# Altium project EPS Subsystem.PrjPcb
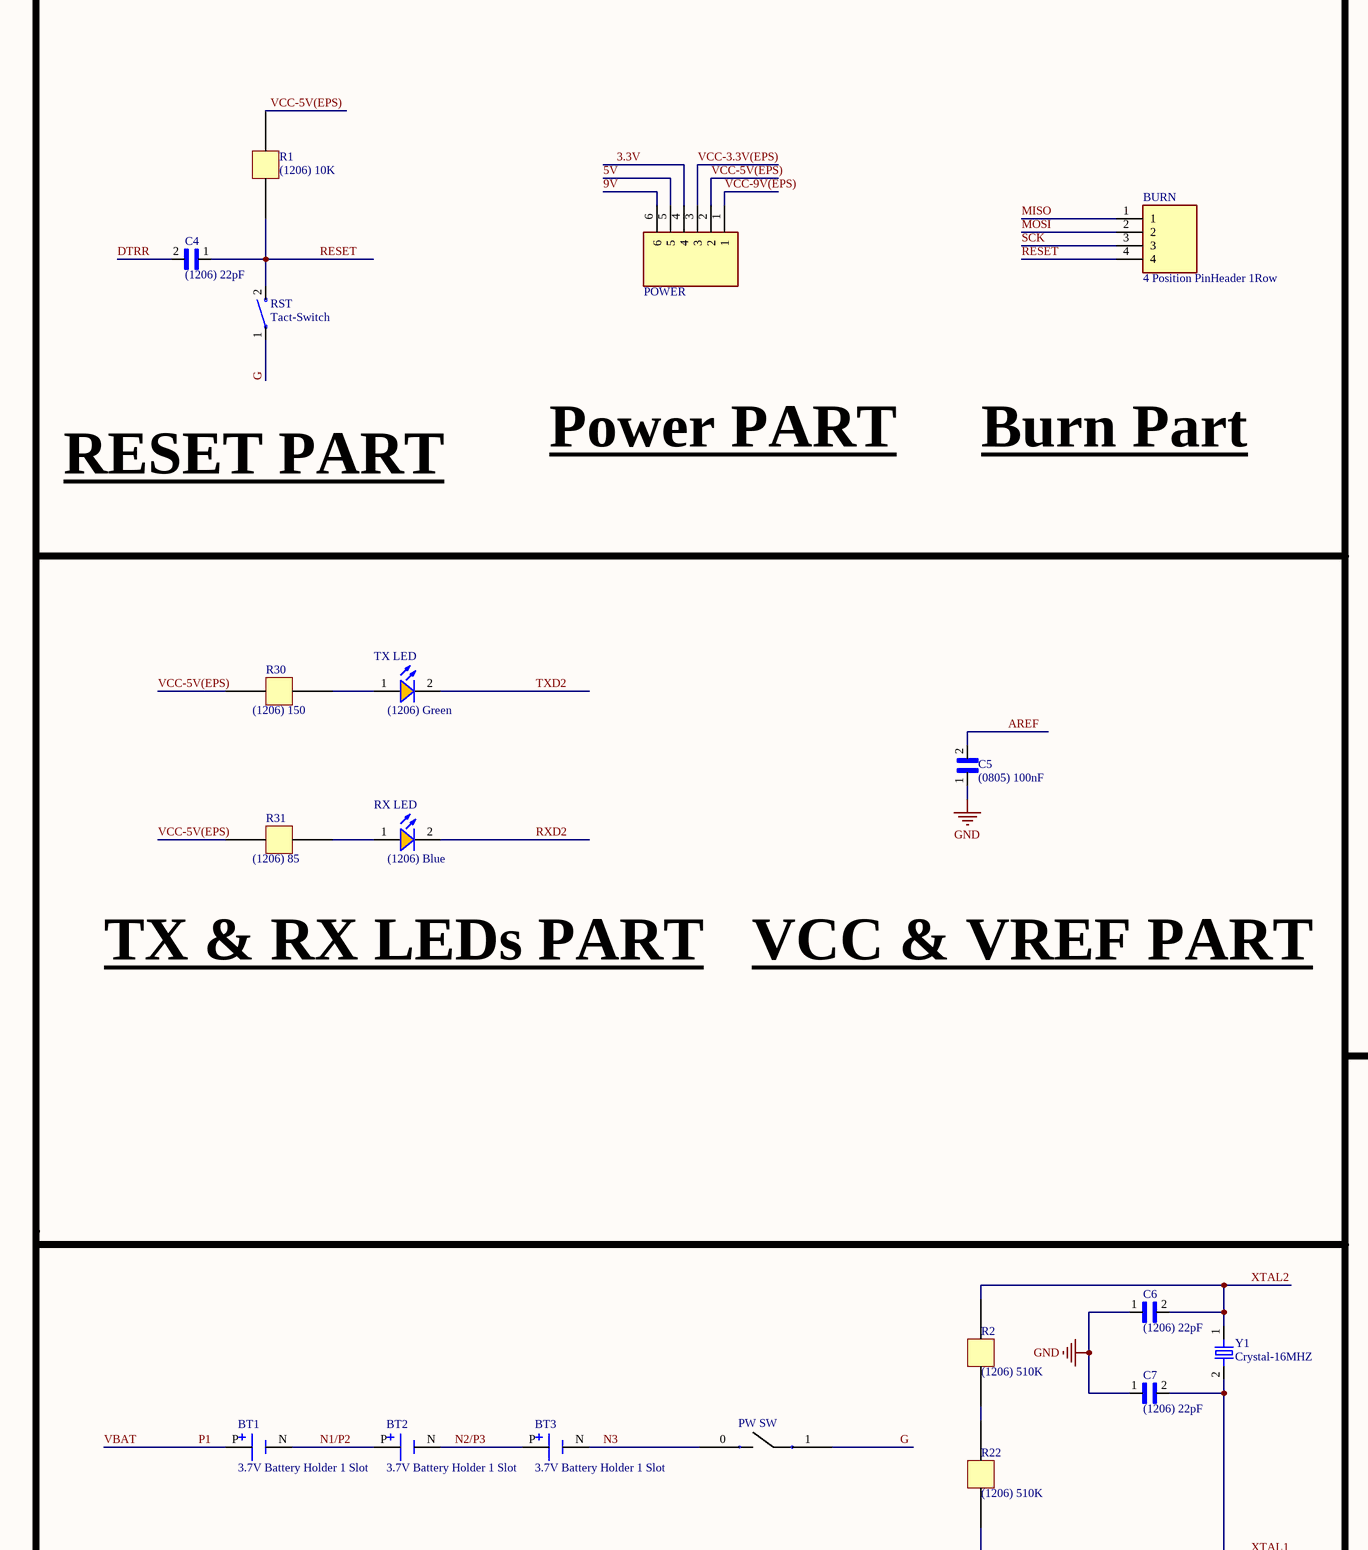
[diagram p0: EPS Subsystem.SchDoc, top left]
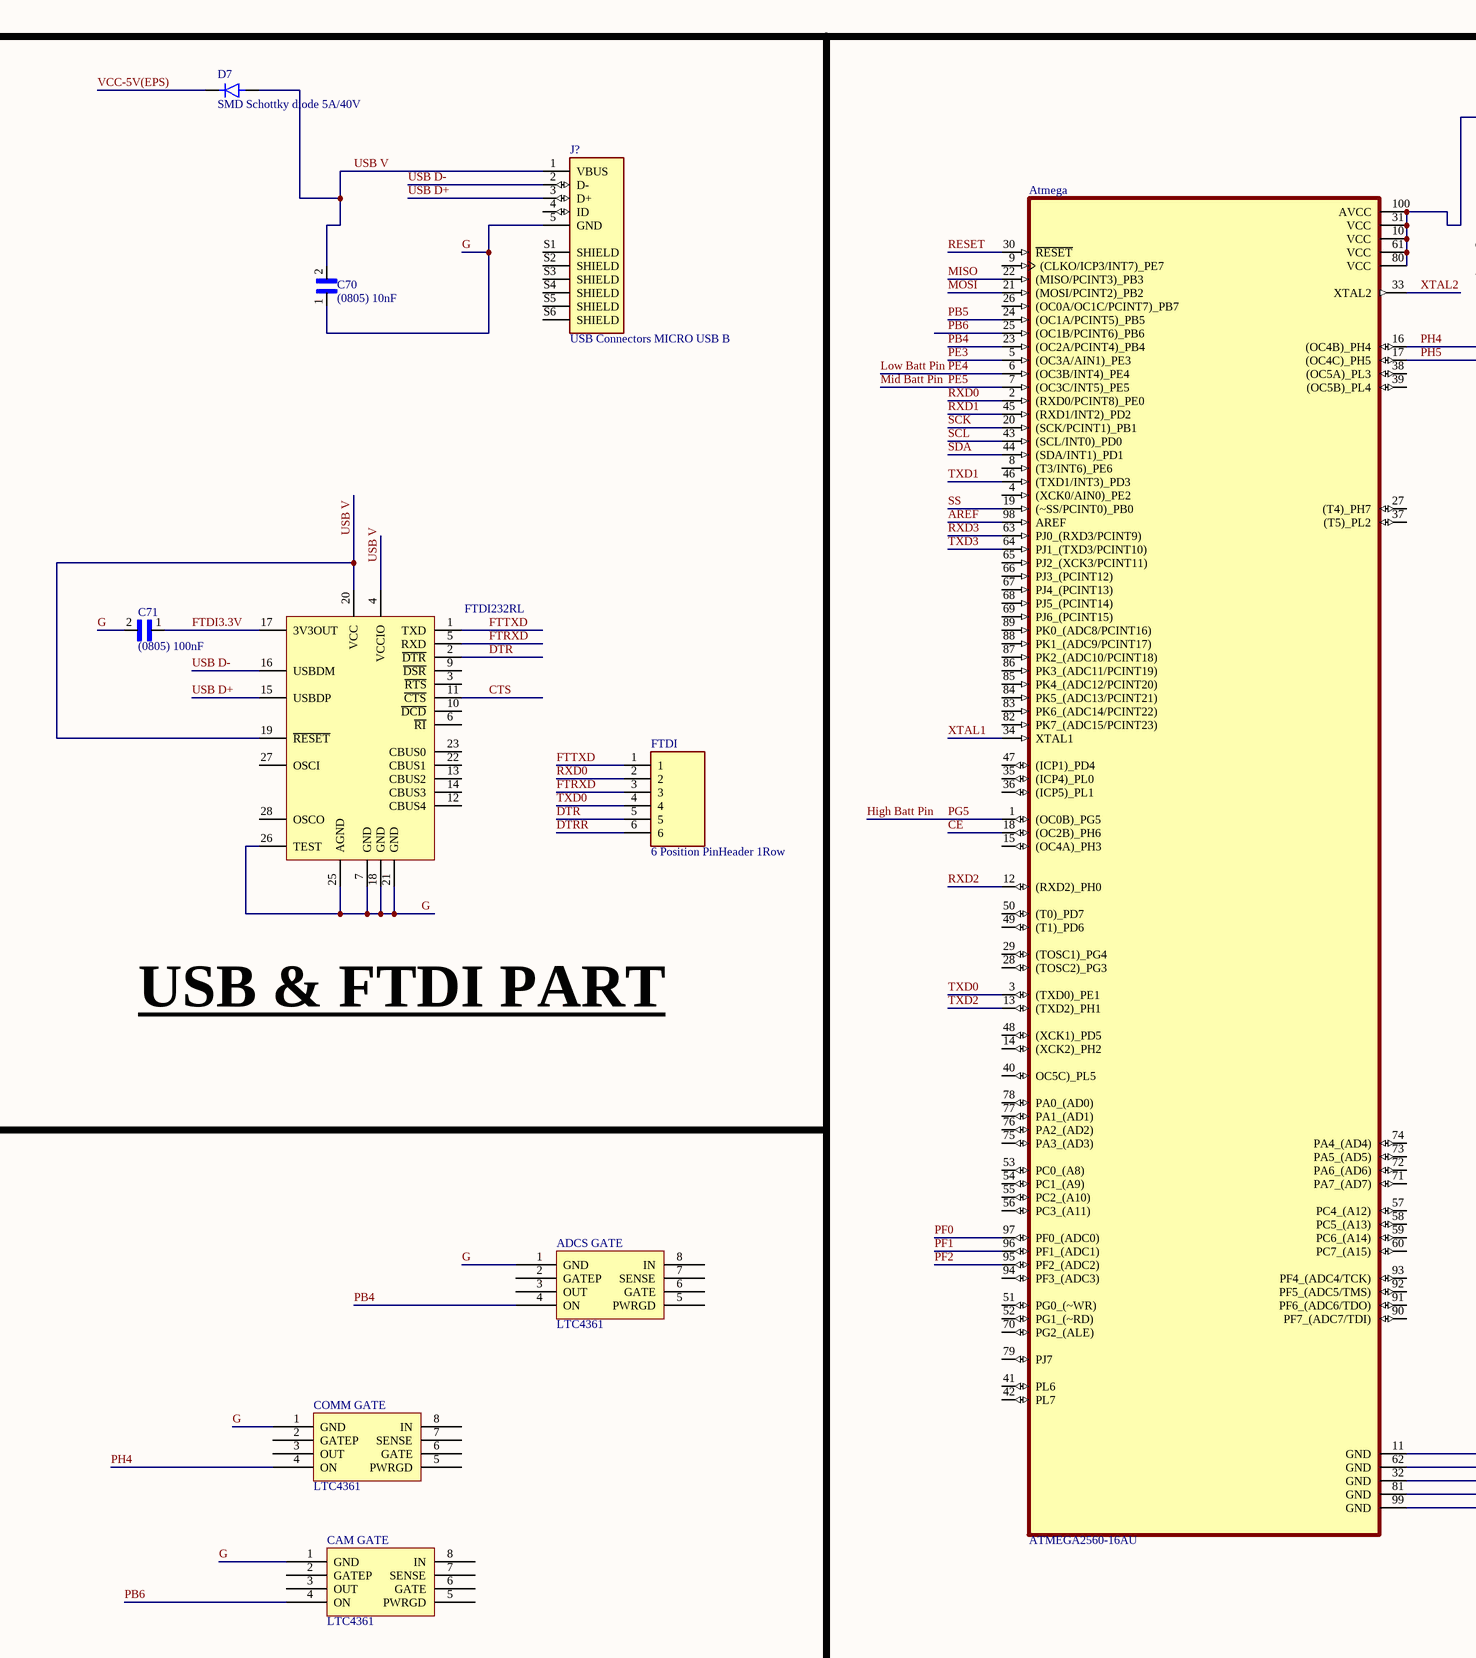
[diagram p1: EPS Subsystem.SchDoc, top middle]
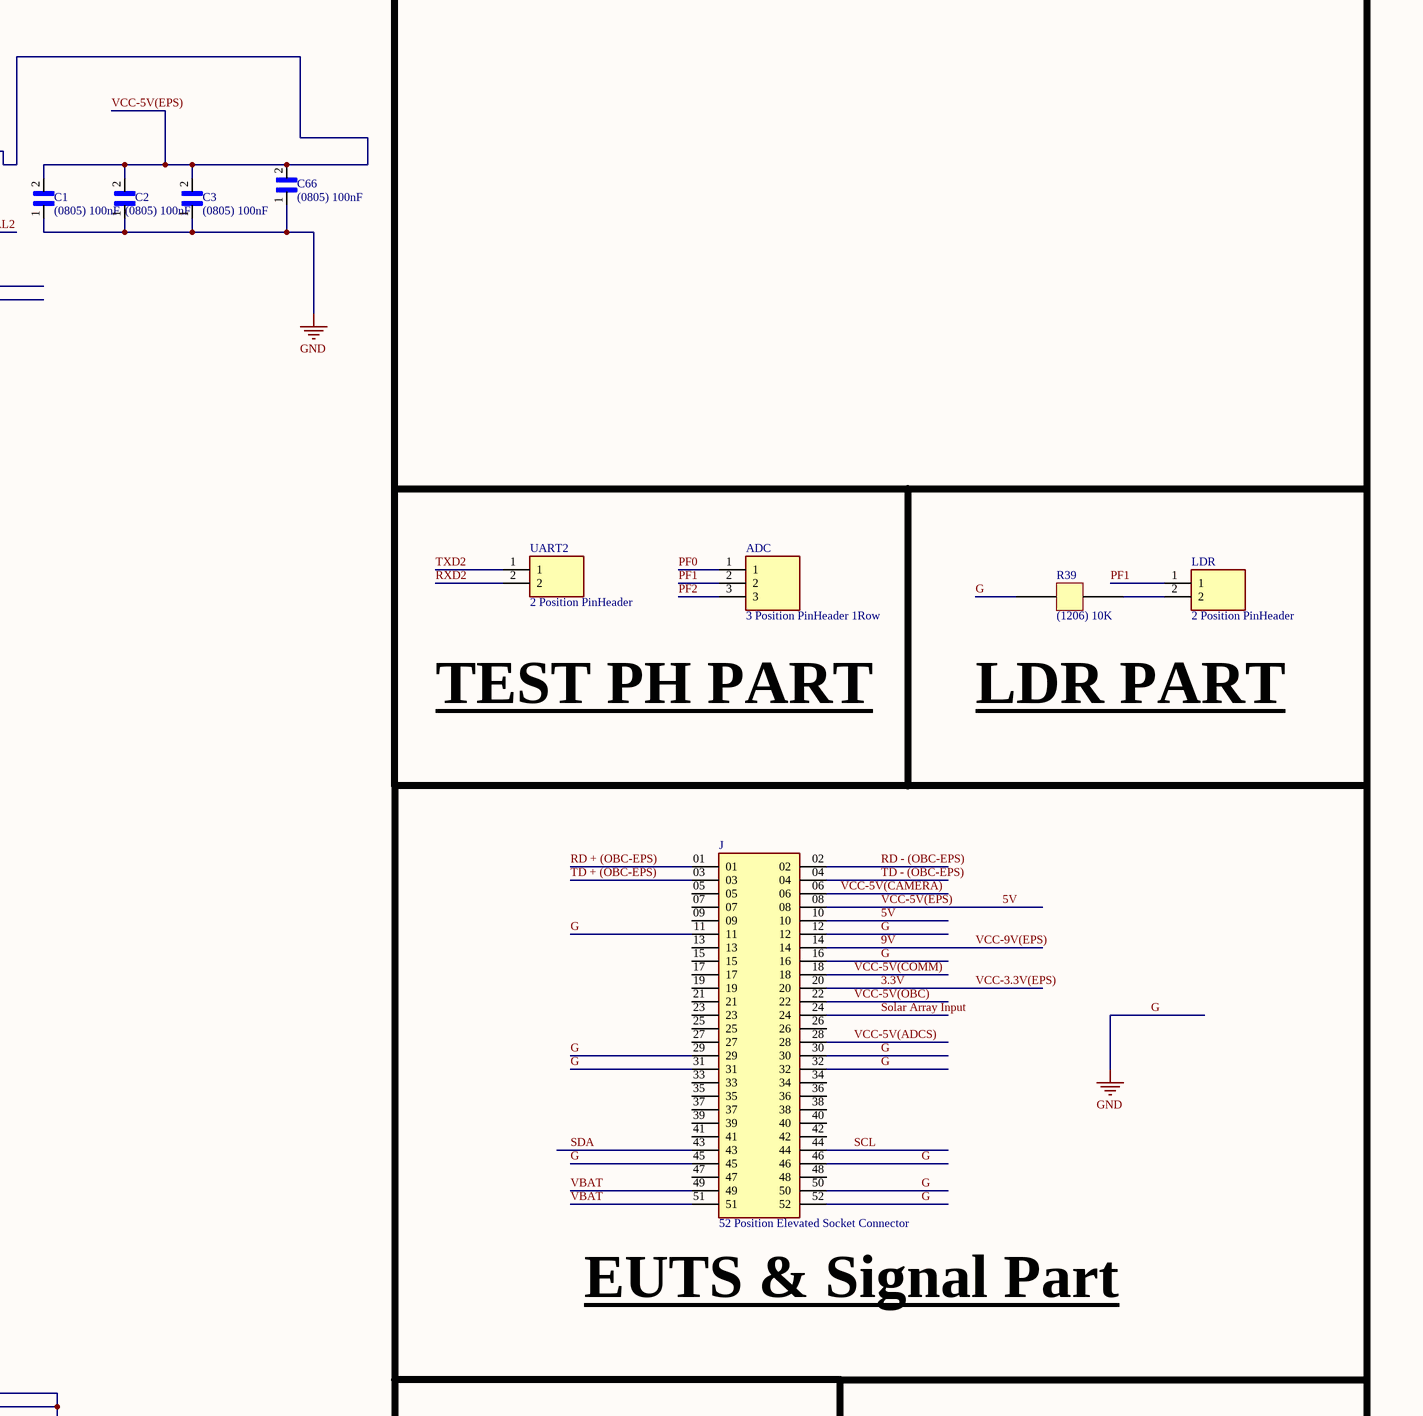
[diagram p2: EPS Subsystem.SchDoc, top right]
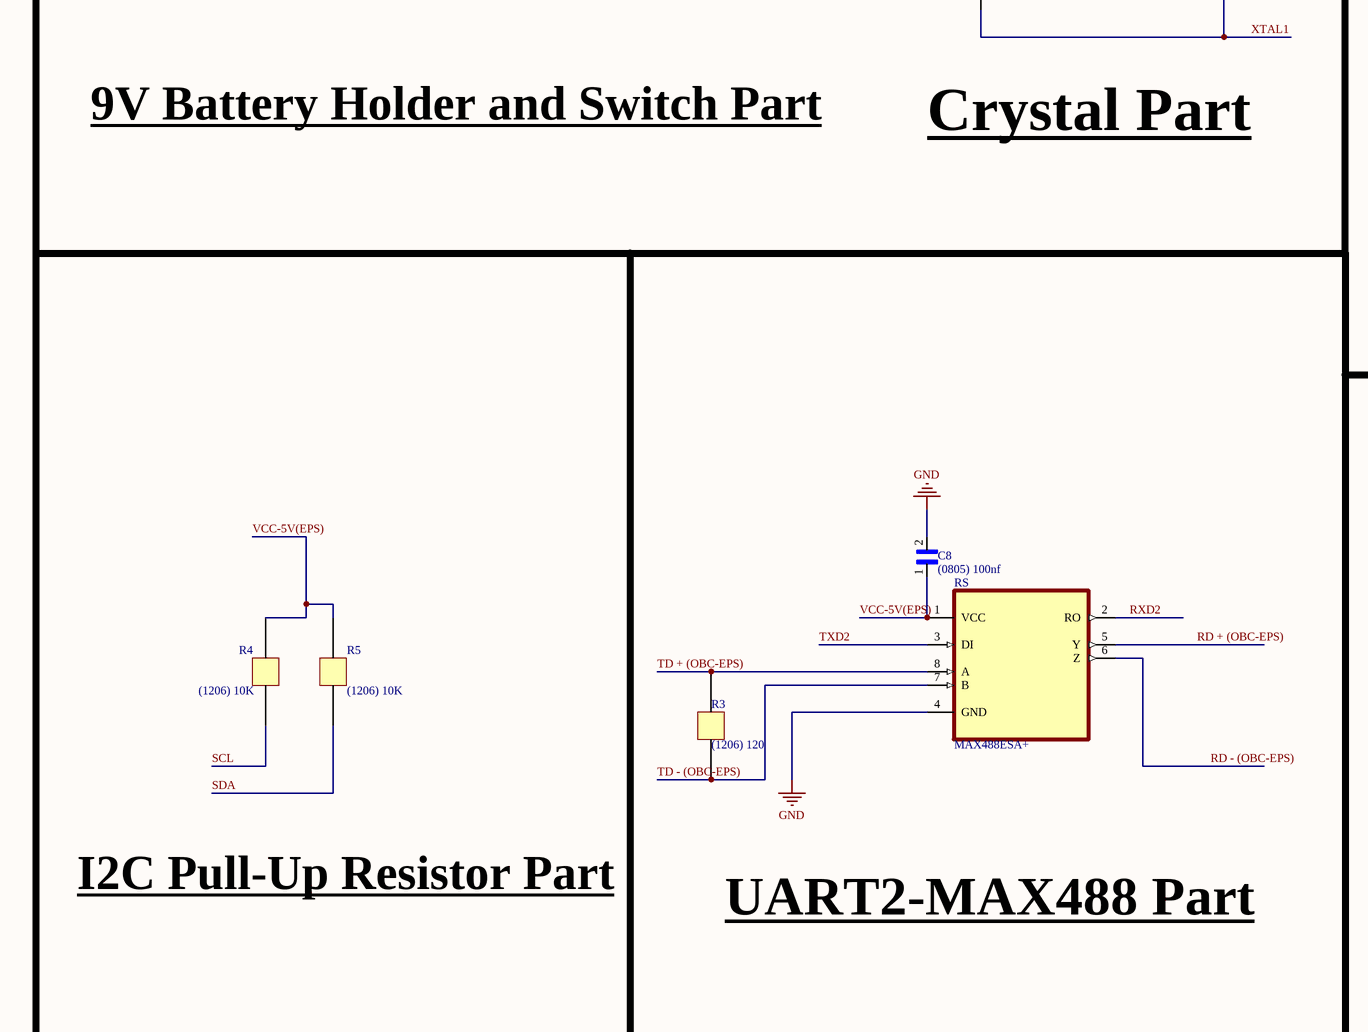
[diagram p3: EPS Subsystem.SchDoc, bottom left]
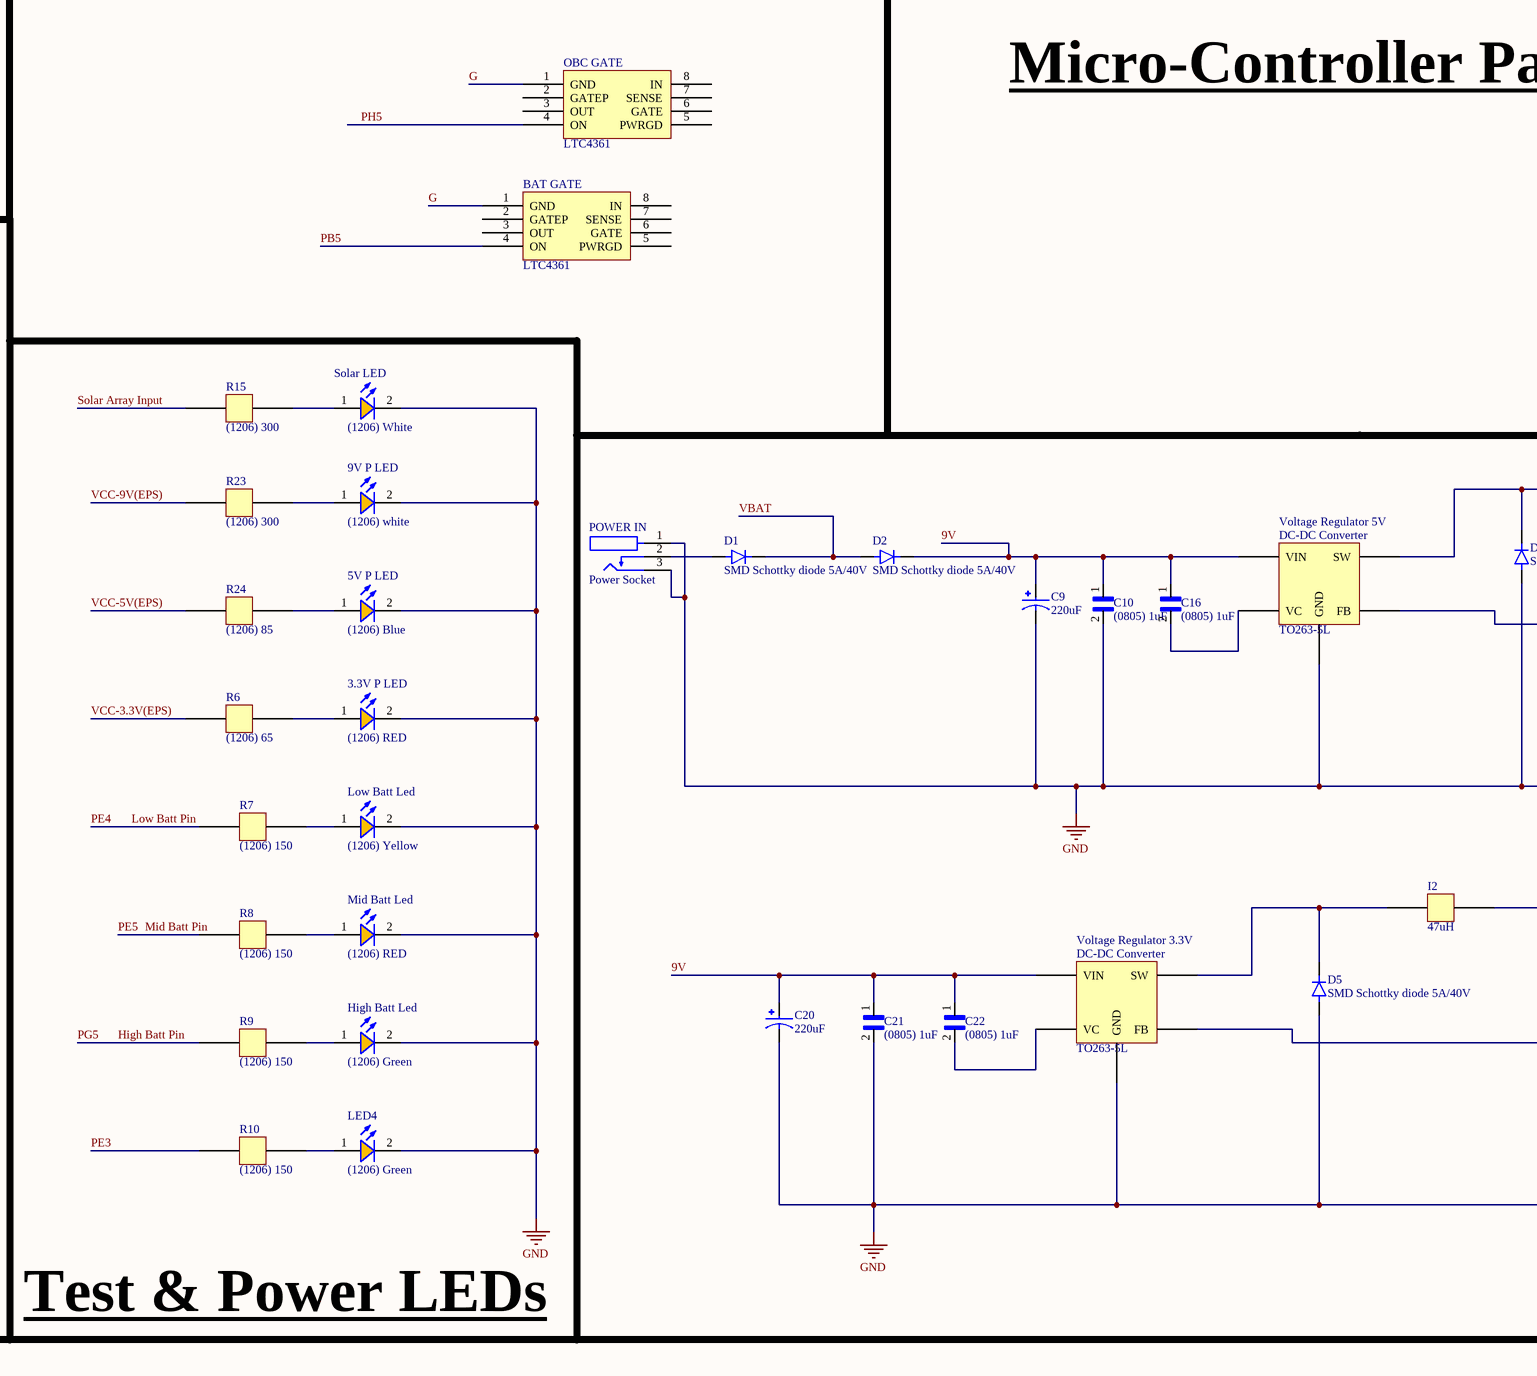
[diagram p4: EPS Subsystem.SchDoc, bottom middle]
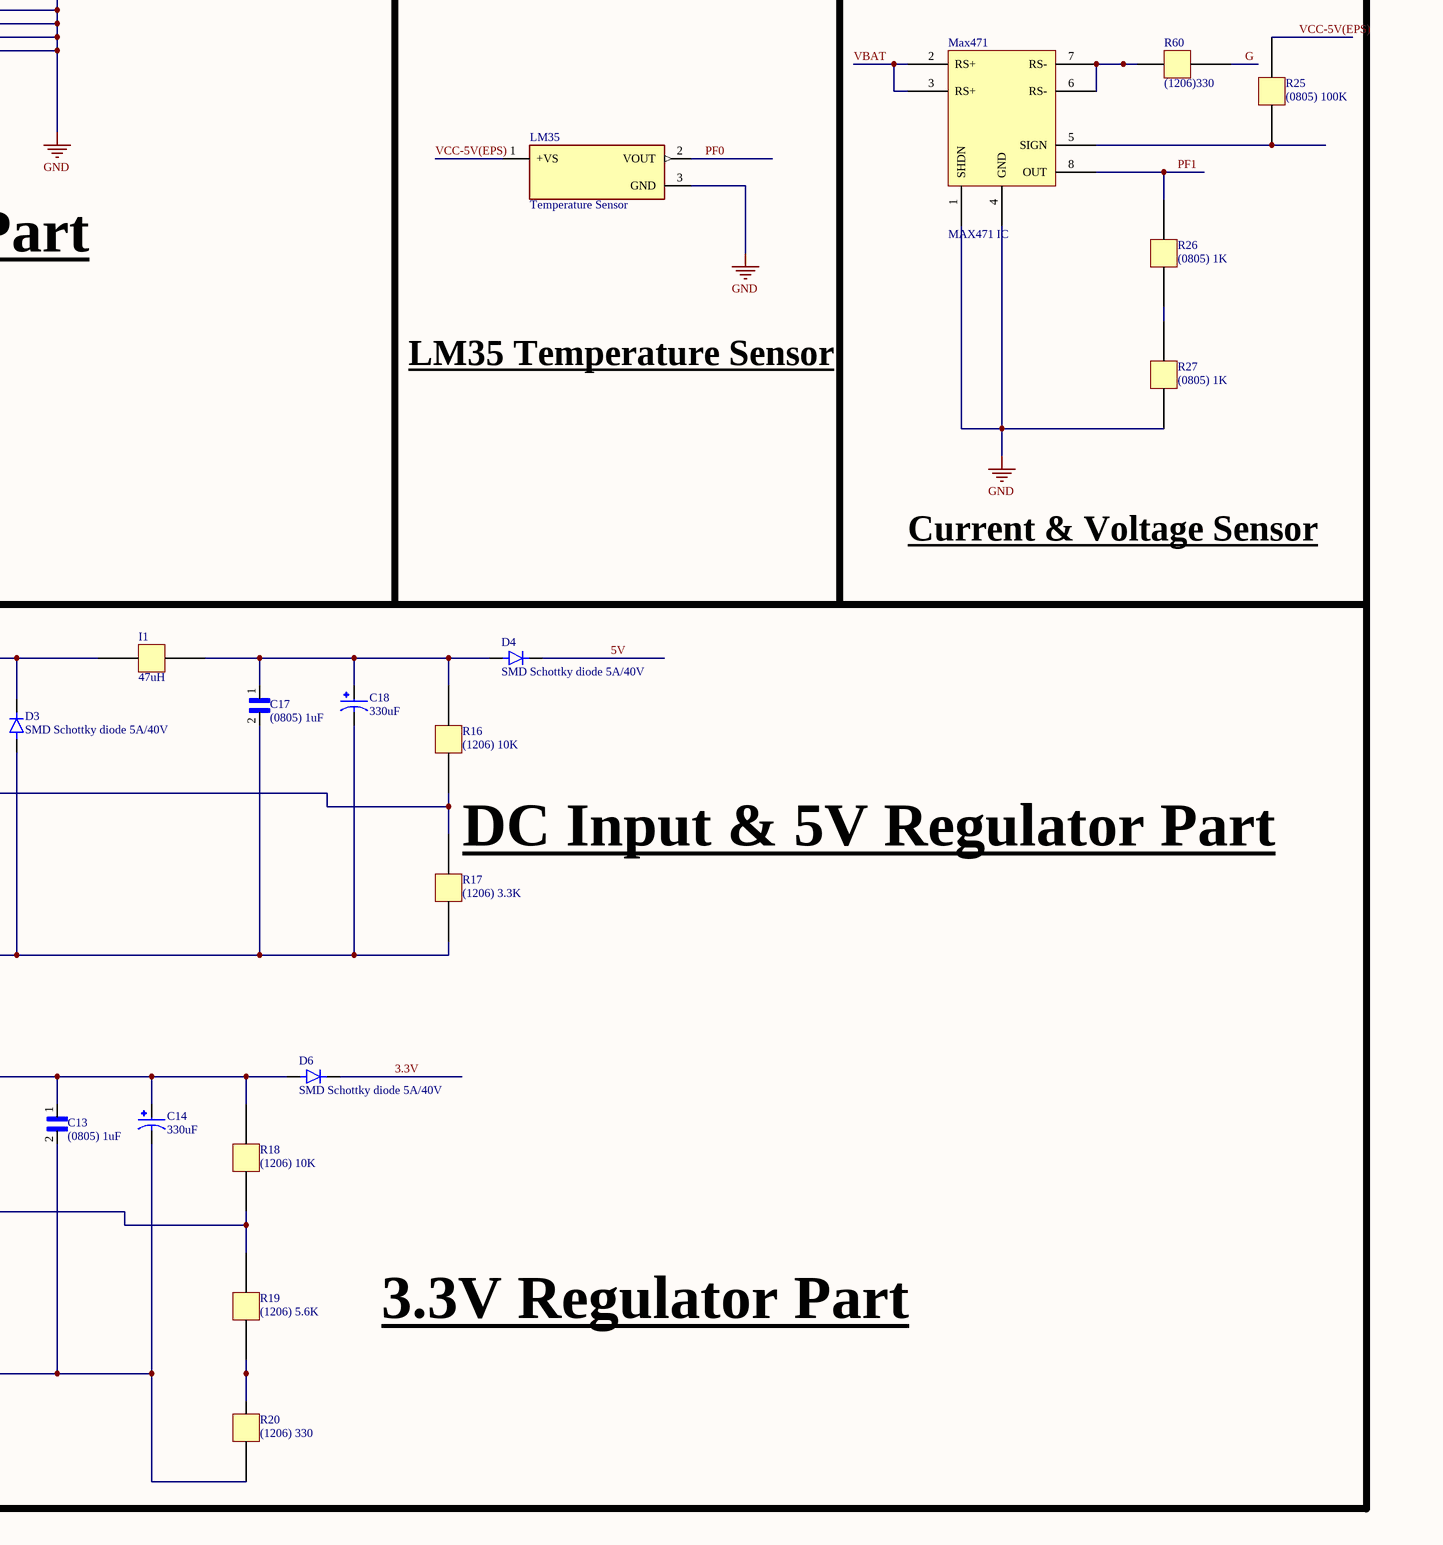
[diagram p5: EPS Subsystem.SchDoc, bottom right]
1 sheet, 93 parts. Net scope: global (net labels, ports and power ports of the same name join across sheets).
Board file: EPS Subsystem.PcbDoc

## Sheet EPS Subsystem.SchDoc
size A1; SheetNumber: 1; SheetTotal: 1

### Parts
3.3V_P_LED  (1206) RED  [RESC3015X65-01]
5V_P_LED  (1206) Blue  [RESC3015X65-01]
9V_P_LED  (1206) white  [RESC3015X65-01]
ADC  3 Position PinHeader 1Row  [TE_3-103327-3]
ADCS_GATE  LTC4361  [LTC4361]
Atmega  ATMEGA2560-16AU  [QFP50P1600X1600X120-100N]
BAT_GATE  LTC4361  [LTC4361]
BT1  3.7V Battery Holder 1 Slot  [BAT_BH-18650-PC]
BT2  3.7V Battery Holder 1 Slot  [BAT_BH-18650-PC]
BT3  3.7V Battery Holder 1 Slot  [BAT_BH-18650-PC]
BURN  4 Position PinHeader 1Row  [TE_3-644456-4]
C1  (0805) 100nF  [CAPC2012X95N-0]
C2  (0805) 100nF  [CAPC2012X95N-0]
C3  (0805) 100nF  [CAPC2012X95N-0]
C4  (1206) 22pF  [CAPC3216X125N0]
C5  (0805) 100nF  [CAPC2012X95N-0]
C6  (1206) 22pF  [CAPC3216X125N0]
C7  (1206) 22pF  [CAPC3216X125N0]
C8  (0805) 100nf  [CAPC2012X95N-0]
C9  220uF  [CAPPRD500W60D1250H2500]
C10  (0805) 1uF  [CAPC2012X95N-0]
C13  (0805) 1uF  [CAPC2012X95N-0]
C14  330uF  [CAPPRD500W60D1250H2500]
C16  (0805) 1uF  [CAPC2012X95N-0]
C17  (0805) 1uF  [CAPC2012X95N-0]
C18  330uF  [CAPPRD500W60D1250H2500]
C20  220uF  [CAPPRD500W60D1250H2500]
C21  (0805) 1uF  [CAPC2012X95N-0]
C22  (0805) 1uF  [CAPC2012X95N-0]
C66  (0805) 100nF  [CAPC2012X95N-0]
C70  (0805) 10nF  [CAPC2012X95N-0]
C71  (0805) 100nF  [CAPC2012X95N-0]
CAM_GATE  LTC4361  [LTC4361]
COMM_GATE  LTC4361  [LTC4361]
D1  SMD Schottky diode 5A/40V  [DIOM5227X270N]
D2  SMD Schottky diode 5A/40V  [DIOM5227X270N]
D3  SMD Schottky diode 5A/40V  [DIOM5227X270N]
D4  SMD Schottky diode 5A/40V  [DIOM5227X270N]
D5  SMD Schottky diode 5A/40V  [DIOM5227X270N]
D6  SMD Schottky diode 5A/40V  [DIOM5227X270N]
D7  SMD Schottky diode 5A/40V  [DIOM5227X270N]
FTDI  6 Position PinHeader 1Row  [TE_6-146285-6]
FTDI232RL  IC_FT232RL  [SSOP-28]  (value not drawn)
High_Batt_Led  (1206) Green  [RESC3015X65-01]
I1  47uH  [IND]
I2  47uH  [IND]
J  52 Position Elevated Socket Connector  [SAMTEC_ESQ-126-39-G-D]
J?  USB Connectors MICRO USB B  [MOLEX_47346-0001]
LDR  2 Position PinHeader  [TE_2-103327-2]
LED4  (1206) Green  [RESC3015X65-01]
LM35  Temperature Sensor  [TO92127P521H735-4]
Low_Batt_Led  (1206) Yellow  [RESC3015X65-01]
Max471  MAX471 IC  [SOIC127P600X168-8N]
Mid_Batt_Led  (1206) RED  [RESC3015X65-01]
OBC_GATE  LTC4361  [LTC4361]
POWER  6 Position PinHeader 1Row  [TE_6-146285-6]  (value not drawn)
POWER_IN  Power Socket  [GRAVITECH_CON-SOCJ-2155]
PW_SW  2 PIN Rocker Switch -SPST on off 6A KCD101  [2 PIN Rocker Switch -SPST ON-OFF 6A KCD101]  (value not drawn)
R1  (1206) 10K  [CAPC3216X125N0]
R2  (1206) 510K  [CAPC3216X125N0]
R3  (1206) 120  [CAPC3216X125N0]
R4  (1206) 10K  [CAPC3216X125N0]
R5  (1206) 10K  [CAPC3216X125N0]
R6  (1206) 65  [CAPC3216X125N0]
R7  (1206) 150  [CAPC3216X125N0]
R8  (1206) 150  [CAPC3216X125N0]
R9  (1206) 150  [CAPC3216X125N0]
R10  (1206) 150  [CAPC3216X125N0]
R15  (1206) 300  [CAPC3216X125N0]
R16  (1206) 10K  [CAPC3216X125N0]
R17  (1206) 3.3K  [CAPC3216X125N0]
R18  (1206) 10K  [CAPC3216X125N0]
R19  (1206) 5.6K  [CAPC3216X125N0]
R20  (1206) 330  [CAPC3216X125N0]
R22  (1206) 510K  [CAPC3216X125N0]
R23  (1206) 300  [CAPC3216X125N0]
R24  (1206) 85  [CAPC3216X125N0]
R25  (0805) 100K  [CAPC2012X95N-0]
R26  (0805) 1K  [CAPC2012X95N-0]
R27  (0805) 1K  [CAPC2012X95N-0]
R30  (1206) 150  [CAPC3216X125N0]
R31  (1206) 85  [CAPC3216X125N0]
R39  (1206) 10K  [CAPC3216X125N0]
R60  (1206)330  [CAPC3216X125N0]
RS  MAX488ESA+  [SOIC127P600X175-8N0]
RST  Tact-Switch  [Tact Switch]
RX_LED  (1206) Blue  [RESC3015X65-01]
Solar_LED  (1206) White  [RESC3015X65-01]
TX_LED  (1206) Green  [RESC3015X65-01]
UART2  2 Position PinHeader  [TE_2-103327-2]
Voltage_Regulator_3.3V  Voltage Regulator  [TO-263-5]  (value not drawn)
Voltage_Regulator_5V  Voltage Regulator  [TO-263-5]  (value not drawn)
Y1  Crystal-16MHZ  [XTAL1140X490X430N-0]

### Nets
G: 3.3V_P_LED.2(K) 5V_P_LED.2(K) 9V_P_LED.2(K) ADCS_GATE.1(GND) Atmega.11(GND) Atmega.32(GND) Atmega.62(GND) Atmega.81(GND) Atmega.99(GND) BAT_GATE.1(GND) C1.1 C2.1 C3.1 C5.1 C6.1 C7.1 C8.2 C9.N C10.2 C13.2 C14.N C17.2 C18.N C20.N C21.2 C66.1 C70.1 C71.2 CAM_GATE.1(GND) COMM_GATE.1(GND) D3.A D5.A FTDI232RL.7(GND) FTDI232RL.18(GND) FTDI232RL.21(GND) FTDI232RL.25(AGND) FTDI232RL.26(TEST) High_Batt_Led.2(K) J.11 J.12 J.16 J.29 J.30 J.31 J.32 J.45 J.46 J.50 J.52 J?.5(GND) LED4.2(K) LM35.3(GND) Low_Batt_Led.2(K) Max471.1(SHDN) Max471.4(GND) Mid_Batt_Led.2(K) OBC_GATE.1(GND) POWER_IN.1 POWER_IN.3 PW_SW.1 R17.1 R20.1 R27.1 R39.1 R60.2 RS.4(GND) RST.1 Solar_LED.2(K) Voltage_Regulator_3.3V.1(GND) Voltage_Regulator_5V.1(GND)  [also labelled GND]
NC: FTDI232RL.8(NC) FTDI232RL.24(NC)
3.3V: D6.C(K) J.20 POWER.3 POWER.4 R6.1  [also labelled VCC-3.3V(EPS)]
5V: Atmega.10(VCC) Atmega.31(VCC) Atmega.61(VCC) Atmega.80(VCC) Atmega.100(AVCC) C1.2 C2.2 C3.2 C8.1 C66.2 D4.C(K) D7.C(K) J.08 J.10 LM35.1(+VS) POWER.2 POWER.5 R1.1 R4.1 R5.1 R24.1 R25.2 R30.1 R31.1 RS.1(VCC)  [also labelled VCC-5V(EPS)]
9V: C9.P C10.1 C16.1 C20.P C21.1 C22.1 D2.C(K) J.14 POWER.1 POWER.6 R23.1 Voltage_Regulator_3.3V.5(VIN) Voltage_Regulator_5V.5(VIN)  [also labelled VCC-9V(EPS)]
\: BT1.P(POS) D1.C(K) D2.A J.49 J.51 Max471.2(RS+) Max471.3(RS+)  [also labelled P1, VBAT]
AREF: Atmega.98(AREF) C5.2
CE: Atmega.18((OC2B)_PH6)
CTS: FTDI232RL.11(~{CTS})
DTR: FTDI.5 FTDI232RL.2(~{DTR})
DTRR: C4.2 FTDI.6
FTDI3.3V: C71.1 FTDI232RL.17(3V3OUT)
FTRXD: FTDI.3 FTDI232RL.5(RXD)
FTTXD: FTDI.1 FTDI232RL.1(TXD)
High Batt Pin: Atmega.1((OC0B)_PG5) R9.1  [also labelled PG5]
Low Batt Pin: Atmega.6((OC3B/INT4)_PE4) R7.1  [also labelled PE4]
Mid Batt Pin: Atmega.7((OC3C/INT5)_PE5) R8.1  [also labelled PE5]
MISO: Atmega.22((MISO/PCINT3)_PB3) BURN.1
MOSI: Atmega.21((MOSI/PCINT2)_PB2) BURN.2
N1/P2: BT1.N(NEG) BT2.P(POS)
N2/P3: BT2.N(NEG) BT3.P(POS)
N3: BT3.N(NEG) PW_SW.0
PB4: ADCS_GATE.4(ON) Atmega.23((OC2A/PCINT4)_PB4)
PB5: Atmega.24((OC1A/PCINT5)_PB5) BAT_GATE.4(ON)
PB6: Atmega.25((OC1B/PCINT6)_PB6) CAM_GATE.4(ON)
PE3: Atmega.5((OC3A/AIN1)_PE3) R10.1
PF0: ADC.1 Atmega.97(PF0_(ADC0)) LM35.2(VOUT)
PF1: ADC.2 Atmega.96(PF1_(ADC1)) LDR.1 Max471.8(OUT) R26.2
PF2: ADC.3 Atmega.95(PF2_(ADC2))
PH4: Atmega.16((OC4B)_PH4) COMM_GATE.4(ON)
PH5: Atmega.17((OC4C)_PH5) OBC_GATE.4(ON)
RD + (OBC-EPS): J.01 RS.5(Y)
RD - (OBC-EPS): J.02 RS.6(Z)
RESET: Atmega.30(~{RESET}) BURN.4 C4.1 R1.2 RST.2
RXD0: Atmega.2((RXD0/PCINT8)_PE0) FTDI.2
RXD1: Atmega.45((RXD1/INT2)_PD2)
RXD2: Atmega.12((RXD2)_PH0) RS.2(RO) RX_LED.2(K) UART2.2
RXD3: Atmega.63(PJ0_(RXD3/PCINT9))
SCK: Atmega.20((SCK/PCINT1)_PB1) BURN.3
SCL: Atmega.43((SCL/INT0)_PD0) J.44 R4.2
SDA: Atmega.44((SDA/INT1)_PD1) J.43 R5.2
Solar Array Input: J.24 R15.1
SS: Atmega.19((~SS/PCINT0)_PB0)
TD + (OBC-EPS): J.03 R3.2 RS.8(A)
TD - (OBC-EPS): J.04 R3.1 RS.7(B)
TXD0: Atmega.3((TXD0)_PE1) FTDI.4
TXD1: Atmega.46((TXD1/INT3)_PD3)
TXD2: Atmega.13((TXD2)_PH1) RS.3(DI) TX_LED.2(K) UART2.1
TXD3: Atmega.64(PJ1_(TXD3/PCINT10))
USB D+: FTDI232RL.15(USBDP) J?.3(D+)
USB D-: FTDI232RL.16(USBDM) J?.2(D-)
USB V: C70.2 D7.A FTDI232RL.4(VCCIO) FTDI232RL.19(~{RESET}) FTDI232RL.20(VCC) J?.1(VBUS)
VCC-5V(ADCS): J.28
VCC-5V(CAMERA): J.06
VCC-5V(COMM): J.18
VCC-5V(OBC): J.22
XTAL1: Atmega.34(XTAL1) C7.2 R22.1 Y1.2
XTAL2: Atmega.33(XTAL2) C6.2 R2.2 Y1.1
Net3.3V_P_LED_1: 3.3V_P_LED.1(A) R6.2
Net5V_P_LED_1: 5V_P_LED.1(A) R24.2
Net9V_P_LED_1: 9V_P_LED.1(A) R23.2
NetC13_1: C13.1 C14.P D6.A I2.2 R18.2
NetC16_2: C16.2 Voltage_Regulator_5V.4(VC)
NetC17_1: C17.1 C18.P D4.A I1.2 R16.2
NetC22_2: C22.2 Voltage_Regulator_3.3V.4(VC)
NetD1_A: D1.A POWER_IN.2
NetD3_C: D3.C(K) I1.1 Voltage_Regulator_5V.3(SW)
NetD5_C: D5.C(K) I2.1 Voltage_Regulator_3.3V.3(SW)
NetHigh_Batt_Led_1: High_Batt_Led.1(A) R9.2
NetLDR_2: LDR.2 R39.2
NetLED4_1: LED4.1(A) R10.2
NetLow_Batt_Led_1: Low_Batt_Led.1(A) R7.2
NetMax471_5: Max471.5(SIGN) R25.1
NetMax471_6: Max471.6(RS-) Max471.7(RS-) R60.1
NetMid_Batt_Led_1: Mid_Batt_Led.1(A) R8.2
NetR2_1: R2.1 R22.2
NetR15_2: R15.2 Solar_LED.1(A)
NetR16_1: R16.1 R17.2 Voltage_Regulator_5V.2(FB)
NetR18_1: R18.1 R19.2 Voltage_Regulator_3.3V.2(FB)
NetR19_1: R19.1 R20.2
NetR26_1: R26.1 R27.2
NetR30_2: R30.2 TX_LED.1(A)
NetR31_2: R31.2 RX_LED.1(A)

Not connected (* = marked no-connect by the designer): ADCS_GATE 2(GATEP) 3(OUT) 5(PWRGD) 6(GATE) 7(SENSE) 8(IN); Atmega 4((XCK0/AIN0)_PE2) 8((T3/INT6)_PE6) 9((CLKO/ICP3/INT7)_PE7) 14((XCK2)_PH2) 15((OC4A)_PH3) 26((OC0A/OC1C/PCINT7)_PB7) 27((T4)_PH7) 28((TOSC2)_PG3) 29((TOSC1)_PG4) 35((ICP4)_PL0) 36((ICP5)_PL1) 37((T5)_PL2) 38((OC5A)_PL3) 39((OC5B)_PL4) 40(OC5C)_PL5) 41(PL6) 42(PL7) 47((ICP1)_PD4) 48((XCK1)_PD5) 49((T1)_PD6) 50((T0)_PD7) 51(PG0_(~WR)) 52(PG1_(~RD)) 53(PC0_(A8)) 54(PC1_(A9)) 55(PC2_(A10)) 56(PC3_(A11)) 57(PC4_(A12)) 58(PC5_(A13)) 59(PC6_(A14)) 60(PC7_(A15)) 65(PJ2_(XCK3/PCINT11)) 66(PJ3_(PCINT12)) 67(PJ4_(PCINT13)) 68(PJ5_(PCINT14)) 69(PJ6_(PCINT15)) 70(PG2_(ALE)) 71(PA7_(AD7)) 72(PA6_(AD6)) 73(PA5_(AD5)) 74(PA4_(AD4)) 75(PA3_(AD3)) 76(PA2_(AD2)) 77(PA1_(AD1)) 78(PA0_(AD0)) 79(PJ7) 82(PK7_(ADC15/PCINT23)) 83(PK6_(ADC14/PCINT22)) 84(PK5_(ADC13/PCINT21)) 85(PK4_(ADC12/PCINT20)) 86(PK3_(ADC11/PCINT19)) 87(PK2_(ADC10/PCINT18)) 88(PK1_(ADC9/PCINT17)) 89(PK0_(ADC8/PCINT16)) 90(PF7_(ADC7/TDI)) 91(PF6_(ADC6/TDO)) 92(PF5_(ADC5/TMS)) 93(PF4_(ADC4/TCK)) 94(PF3_(ADC3)); BAT_GATE 2(GATEP) 3(OUT) 5(PWRGD) 6(GATE) 7(SENSE) 8(IN); CAM_GATE 2(GATEP) 3(OUT) 5(PWRGD) 6(GATE) 7(SENSE) 8(IN); COMM_GATE 2(GATEP) 3(OUT) 5(PWRGD) 6(GATE) 7(SENSE) 8(IN); FTDI232RL 3(~{RTS}) 6(~{RI}) 9(~{DSR}) 10(~{DCD}) 12(CBUS4) 13(CBUS2) 14(CBUS3) 22(CBUS1) 23(CBUS0) 27(OSCI) 28(OSCO); J 05 07 09 13 15 17 19 21 23 25 26 27 33 34 35 36 37 38 39 40 41 42 47 48; J? 4(ID) S1(SHIELD) S2(SHIELD) S3(SHIELD) S4(SHIELD) S5(SHIELD) S6(SHIELD); OBC_GATE 2(GATEP) 3(OUT) 5(PWRGD) 6(GATE) 7(SENSE) 8(IN)

### Notes on the sheet
- Power PART
- Burn Part
- RESET PART
- TEST PH PART
- LDR PART
- TX & RX LEDs PART
- VCC & VREF PART
- USB & FTDI PART
- (near J) EUTS & Signal Part
- 9V Battery Holder and Switch Part
- Crystal Part
- Micro-Controller Part
- LM35 Temperature Sensor
- Current & Voltage Sensor
- (near R17) DC Input & 5V Regulator Part
- I2C Pull-Up Resistor Part
- UART2-MAX488 Part
- 3.3V Regulator Part
- Test & Power LEDs
- (in symbol Voltage Regulator) DC-DC Converter; TO263-5L

### Library data of the parts
3.3V_P_LED 5V_P_LED 9V_P_LED High_Batt_Led LED4 Low_Batt_Led Mid_Batt_Led RX_LED Solar_LED TX_LED = LED 1206: LED SMD 1206 High Quality Forward Voltage: 3.2 V / Brightness: 700 mcd; Manufacturer: Wurth Elektronik; Manufacturer Part Number: 150060AS75003; Chip Technology: AlInGaP; Dominant Wavelength: 605nm; Emitting Color: Amber; Forward Voltage: 2V; Luminous Intensity: 350mcd; Peak Wavelength: 610nm; Viewing Angle: 140°; ComponentLink1Description: Manufacturer Link; ComponentLink1URL: http://www.we-online.de; ComponentLink2Description: Datasheet; ComponentLink2URL: https://www.we-online.com/catalog/datasheet/150060AS75003.pdf; Height: 0.7mm; Length: 1.6mm; Mounting Technology: SMT; Operating Temperature max.: 100C; Operating Temperature min.: -40C; Packaging: Tape and Reel; Size: 0603; Width: 0.8mm
ADC = 3 Position PinHeader 1Row: Conn Unshrouded Header HDR 3 POS 2.54mm Solder ST Thru-Hole Carton; MF: TE Connectivity; MP: 4-103327-5; Package: None; Value: *; TE_purchase_URL: https://www.te.com/usa-en/product-4-103327-5.html?te_bu=Cor&te_type=disp&te_campaign=seda_glo_cor-seda-global-disp-prtnr-fy19-seda-model-bom-cta_sma-317_1&elqCampaignId=32493; Price: None; SnapEDA_Link: https://www.snapeda.com/parts/4-103327-5/TE%20Connectivity%20AMP%20Connectors/view-part/2403997/?ref=snap; Availability: Unavailable; EU_RoHS_Compliance: Compliant
BT1-BT3 = 3.7V Battery Holder 1 Slot: Battery Holder _Open_ 18650 1 Cell PC Pin; MF: MPD _Memory; MP: BH-18650-PC; Package: DFN-8 Memory Protection Devices; Value: *; Availability: Unavailable; SnapEDA_Link: https://www.snapeda.com/parts/BH-18650-PC/MPD%20%28Memory%20Protection%20Devices%29/view-part/779074/?ref=snap; Price: None
BURN = 4 Position PinHeader 1Row: Conn Unshrouded Header HDR 4 POS 2.54mm Solder ST Thru-Hole Bag/Box; MP: 3-644456-4; Number_of_Positions: 4; Product_Type: Connector; MF: TE Connectivity; Centerline_Pitch: 2.54 mm[.1 in]; Package: None; Availability: Warning; EU_RoHS_Compliance: Compliant; SnapEDA_Link: https://www.snapeda.com/parts/3-644456-4/TE%20Connectivity%20AMP%20Connectors/view-part/482664/?ref=snap; DigiKey-Purchase-URL: https://snapeda.com/shop?store=DigiKey&id=482664; Mouser-Purchase-URL: https://snapeda.com/shop?store=Mouser&id=482664; Price: None; Value: *
C1-C3 C5 C8 C10 C13 C16 C17 C21 C22 C66 C70 C71 = Capacitor 0805: UMK212SD103KD-T/CAP CER 10000PF 50V 0805; Package: None; Price: None; Value: *; MP: UMK212SD103KD-T; Availability: Unavailable
C4 C6 C7 = Capacitor 1206: UMF316B7103KFHT/1206 Capacitor; Package: None; Price: None; Value: *; MP: UMF316B7103KFHT; Availability: Unavailable
C9 C14 C18 C20 = Aluminum Electrolytic Capacitor: Aluminum Electrolytic Capacitors - Radial Leaded 47uF 250volts AEC-Q200; MP: EEUEB2E470B; MF: Panasonic; Availability: In Stock; SnapEDA_Link: https://www.snapeda.com/parts/EEUEB2E470B/Panasonic/view-part/?ref=snap; Value: *; Price: None; Package: RADIAL-2 Panasonic; Check_prices: https://www.snapeda.com/parts/EEUEB2E470B/Panasonic/view-part/?ref=eda
D1-D7 = SMD Schottky diode 5A/40V: S1 Series 1000 V 1 A 1 uA Surface Mount General Purpose Rectifier - DO-214AC; MP: S1M; Price: None; Value: *; Availability: Unavailable; Package: None
FTDI POWER = 6 Position PinHeader 1Row: Connector Header Through Hole 6 position 0.100 (2.54mm); MP: 5-146285-6; MF: TE Connectivity; DigiKey-Purchase-URL: https://snapeda.com/shop?store=DigiKey&id=2411669; EU_RoHS_Compliance: Compliant; Package: None; Value: *; SnapEDA_Link: https://www.snapeda.com/parts/5-146285-6/TE%20Connectivity%20AMP%20Connectors/view-part/2411669/?ref=snap; Digi-Key_Part_Number: A122872-ND
FTDI232RL = IC_FT232RL: FT232R USB UART; Manufacturer: *; Note: *; ManufacturerPartNo: *
I1 I2 = Inductor DIP
J = 52 Position Elevated Socket Connector: ESQ-126-39-G-D/52 Position Elevated Socket Connector Through Hole; MF: Samtec; Package: None; MP: ESQ-126-39-G-D; Value: *; Availability: Unavailable; Price: None; SnapEDA_Link: https://www.snapeda.com/parts/ESQ-126-39-G-D/Samtec%20Inc./view-part/490181/?ref=snap
J? = USB Connectors MICRO USB B: USB Connectors MICRO USB B RECPT BTTM MOUNT ASSY; MP: 47346-0001; MF: Molex; Package: None; Purchase-URL: https://pricing.snapeda.com/search/part/47346-0001/?ref=eda; Check_prices: https://www.snapeda.com/parts/47346-0001/Molex/view-part/53503/?ref=eda; Value: *; Availability: Warning; Price: None; SnapEDA_Link: https://www.snapeda.com/parts/47346-0001/Molex/view-part/53503/?ref=snap
LDR UART2 = 2 Position PinHeader: Cabezal del conector Agujero pasante 2 posiciones 0,100 (2,54 mm); MP: 4-103327-4; MF: TE Connectivity; SnapEDA_Link: https://www.snapeda.com/parts/4-103327-4/TE%20Connectivity%20AMP%20Connectors/view-part/2403998/?ref=snap; Purchase-URL: https://pricing.snapeda.com/search/part/4-103327-4/?ref=eda; Value: *; Package: None; EU_RoHS_Compliance: Compliant; Price: None; Availability: Warning; Check_prices: https://www.snapeda.com/parts/4-103327-4/TE%20Connectivity%20AMP%20Connectors/view-part/2403998/?ref=eda
LM35 = LM35DZ/NOPB/Temperature Sensor: LM35DZ/NOPB/Temperature Sensor Analog, Local 0Â°C ~ 100Â°C 10mV/Â°C TO-92-3; MF: Texas Instruments; MP: LM35DZ; Value: *; SnapEDA_Link: https://www.snapeda.com/parts/LM35DZ/Texas+Instruments/view-part/?ref=snap; Price: None; Availability: Not in stock; Package: E-PKG AXIAL-LEADED-2 ON Semiconductor; Check_prices: https://www.snapeda.com/parts/LM35DZ/Texas+Instruments/view-part/?ref=eda
POWER_IN = Power Socket: CON-SOCJ-2155\DC Power Connectors Power Jack/Connector 2.1mm x 5.5mm; Price: None; Package: None; Availability: Unavailable; MP: CON-SOCJ-2155; Value: *
R1-R10 R15-R20 R22-R24 R30 R31 R39 R60 = Resistor 1206
R25-R27 = Resistor 0805
RS = MAX488ESA+: 1/1 Transceiver Full RS422, RS485 8-SOIC; MP: MAX488ESA+T; MF: Maxim Integrated; Price: None; Package: SOIC-8 Maxim; Availability: Unavailable; SnapEDA_Link: https://www.snapeda.com/parts/MAX488ESA+T/Maxim%20Integrated/view-part/48834/?ref=snap; Value: *
RST = Tact-Switch: High Quality 3x6x2.7 mm SMD White Push Button Switch (Tact Switch); MP: 1437566-3; Price: None; Value: *; Package: None; Availability: Unavailable
Voltage_Regulator_3.3V Voltage_Regulator_5V = Voltage Regulator: TO-263-5/XL4015E1 5A 75W Adjustable DC/DC STEP DOWN CONVERTER Regulator IC SMD
Atmega = ATMEGA2560-16AU: Value: *; MP: ATMEGA2560-16AU; Package: None; Availability: Unavailable; Price: None